# EAGLE design PAPx2-3 (EAGLE 7.2.0)
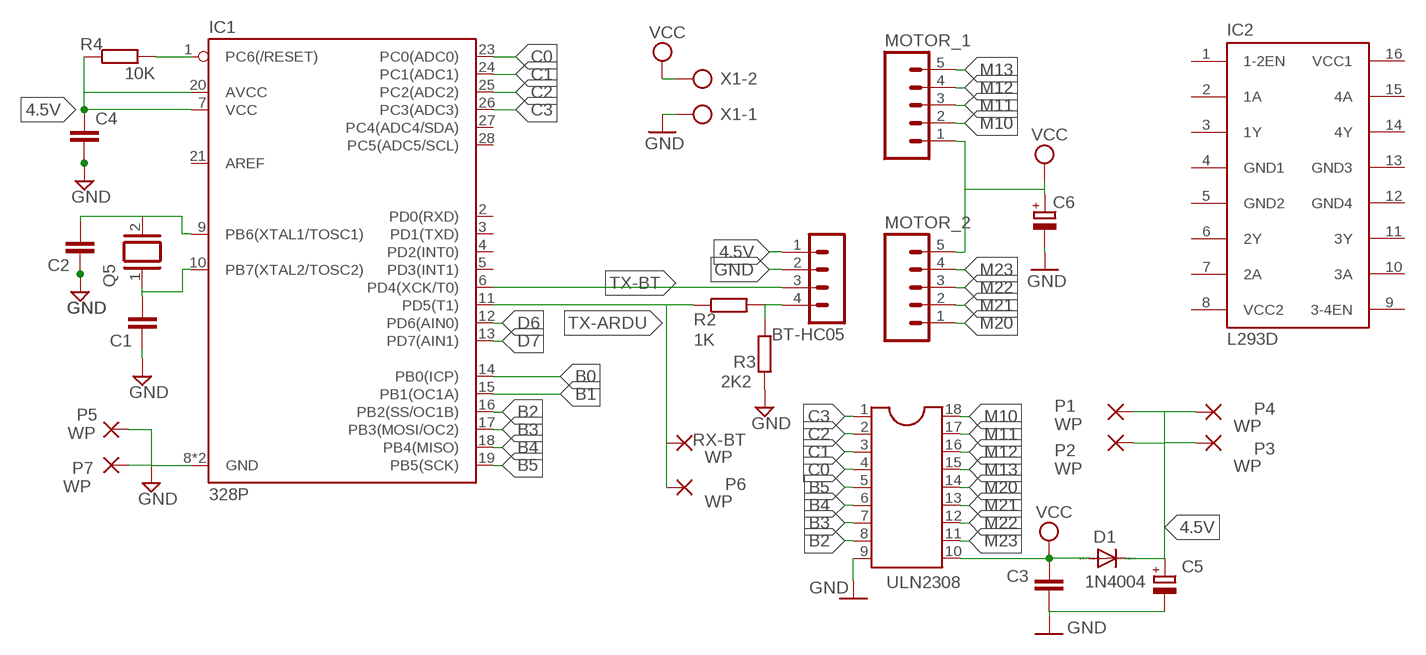
[diagram p0: schematic, sheet 1]

## Parts
BT-HC05  MA04-1  [MA04-1]
C1  C-EU025-025X050  [C025-025X050]
C2  C-EU025-025X050  [C025-025X050]
C3  C-EU050-025X075  [C050-025X075]
C4  C-EU050-025X075  [C050-025X075]
C5  CPOL-EUE2.5-5  [E2,5-5]
C6  CPOL-EUE2.5-5  [E2,5-5]
D1  1N4004  [DO41-10]
IC1  328P  ATMEGA328P  [DIP28]
IC2  L293D  [DIL16]
MOTOR_1  M05  [05P]
MOTOR_2  M05  [05P]
P1  WP  WIREPAD1,6/0,8  [1,6/0,8]
P2  WP  WIREPAD1,6/0,8  [1,6/0,8]
P3  WP  WIREPAD1,6/0,8  [1,6/0,8]
P4  WP  WIREPAD1,6/0,8  [1,6/0,8]
P5  WP  WIREPAD1,6/0,8  [1,6/0,8]
P6  WP  WIREPAD1,6/0,8  [1,6/0,8]
P7  WP  WIREPAD1,6/0,8  [1,6/0,8]
Q5  XTAL/S  [QS]
R2  1K  R-EU_0204/7  [0204/7]
R3  2K2  R-EU_0204/7  [0204/7]
R4  10K  R-EU_0204/7  [0204/7]
RX-BT  WP  WIREPAD1,6/0,8  [1,6/0,8]
ULN2308  DIL18  [DIL18]
X1  AK500/2  [AK500/2]

## Nets
4.5V: BT-HC05.1 C4.1 C5.+ D1.C IC1.7(VCC) IC1.20(AVCC) P1.1(P) P2.1(P) P3.1(P) P4.1(P) R4.1
B0: IC1.14(PB0(ICP))
B1: IC1.15(PB1(OC1A))
B2: IC1.16(PB2(SS/OC1B)) ULN2308.8
B3: IC1.17(PB3(MOSI/OC2)) ULN2308.7
B4: IC1.18(PB4(MISO)) ULN2308.6
B5: IC1.19(PB5(SCK)) ULN2308.5
C0: IC1.23(PC0(ADC0)) ULN2308.4
C1: IC1.24(PC1(ADC1)) ULN2308.3
C2: IC1.25(PC2(ADC2)) ULN2308.2
C3: IC1.26(PC3(ADC3)) ULN2308.1
D6: IC1.12(PD6(AIN0))
D7: IC1.13(PD7(AIN1))
GND: BT-HC05.2 C1.1 C2.1 C3.2 C4.2 C5.- C6.- IC1.8(GND) IC1.22(GND) P5.1(P) P7.1(P) R3.1 ULN2308.9 X1.1
M10: MOTOR_1.2 ULN2308.18
M11: MOTOR_1.3 ULN2308.17
M12: MOTOR_1.4 ULN2308.16
M13: MOTOR_1.5 ULN2308.15
M20: MOTOR_2.1 ULN2308.14
M21: MOTOR_2.2 ULN2308.13
M22: MOTOR_2.3 ULN2308.12
M23: MOTOR_2.4 ULN2308.11
N$1: BT-HC05.4 R2.2 R3.2
N$2: C1.2 IC1.10(PB7(XTAL2/TOSC2)) Q5.1
N$3: C2.2 IC1.9(PB6(XTAL1/TOSC1)) Q5.2
N$4: IC1.1(PC6(/RESET)) R4.2
TX-ARDU: IC1.11(PD5(T1)) P6.1(P) R2.1 RX-BT.1(P)
TX-BT: BT-HC05.3 IC1.6(PD4(XCK/T0))
VCC: C3.1 C6.+ D1.A MOTOR_1.1 MOTOR_2.5 ULN2308.10 X1.2
Unconnected: IC1.2(PD0(RXD)) IC1.3(PD1(TXD)) IC1.4(PD2(INT0)) IC1.5(PD3(INT1)) IC1.21(AREF) IC1.27(PC4(ADC4/SDA)) IC1.28(PC5(ADC5/SCL)) IC2.1(1-2EN) IC2.2(1A) IC2.3(1Y) IC2.6(2Y) IC2.7(2A) IC2.9(3-4EN) IC2.10(3A) IC2.11(3Y) IC2.14(4Y) IC2.15(4A)

## Power pins joined to a net without a drawn wire
GND1: IC2.4(GND1)
GND2: IC2.5(GND2)
GND3: IC2.13(GND3)
GND4: IC2.12(GND4)
VCC1: IC2.16(VCC1)
VCC2: IC2.8(VCC2)

## Library data of the parts
BT-HC05 = con-lstb:MA04-1: PIN HEADER; OC_FARNELL: unknown; OC_NEWARK: unknown
C1-C4 = rcl:C-EU: CAPACITOR, European symbol
C5 C6 = resistor:CPOL-EU: POLARIZED CAPACITOR, European symbol
D1 = diode:1N4004: DIODE general purpose rectifier, 1 A
IC1 = treser_lib:ATMEGA328P: Atmel ATMEGA328P 32kb flash, 1k EEPROM, 2k SRAM; PROD_ID: IC-09136
IC2 = treser_lib:L293D: Driver L293D Driver PUSH-PULL de 4 canales; MPN: L293D; OC_FARNELL: 9589619; OC_NEWARK: 56P8249
MOTOR_1 MOTOR_2 = con-amp-quick:M05: AMP QUICK CONNECTOR; OC_FARNELL: unknown; OC_NEWARK: unknown
P1-P7 RX-BT = wirepad:WIREPAD: Wire PAD connect wire on PCB
Q5 = special:XTAL/S: CRYSTAL
R2-R4 = resistor:R-EU_: RESISTOR, European symbol
ULN2308 = ic-package:DIL18: Dual In Line / Socket
X1 = con-ptr500:AK500/2: CONNECTOR; OC_FARNELL: unknown; OC_NEWARK: unknown

## Board
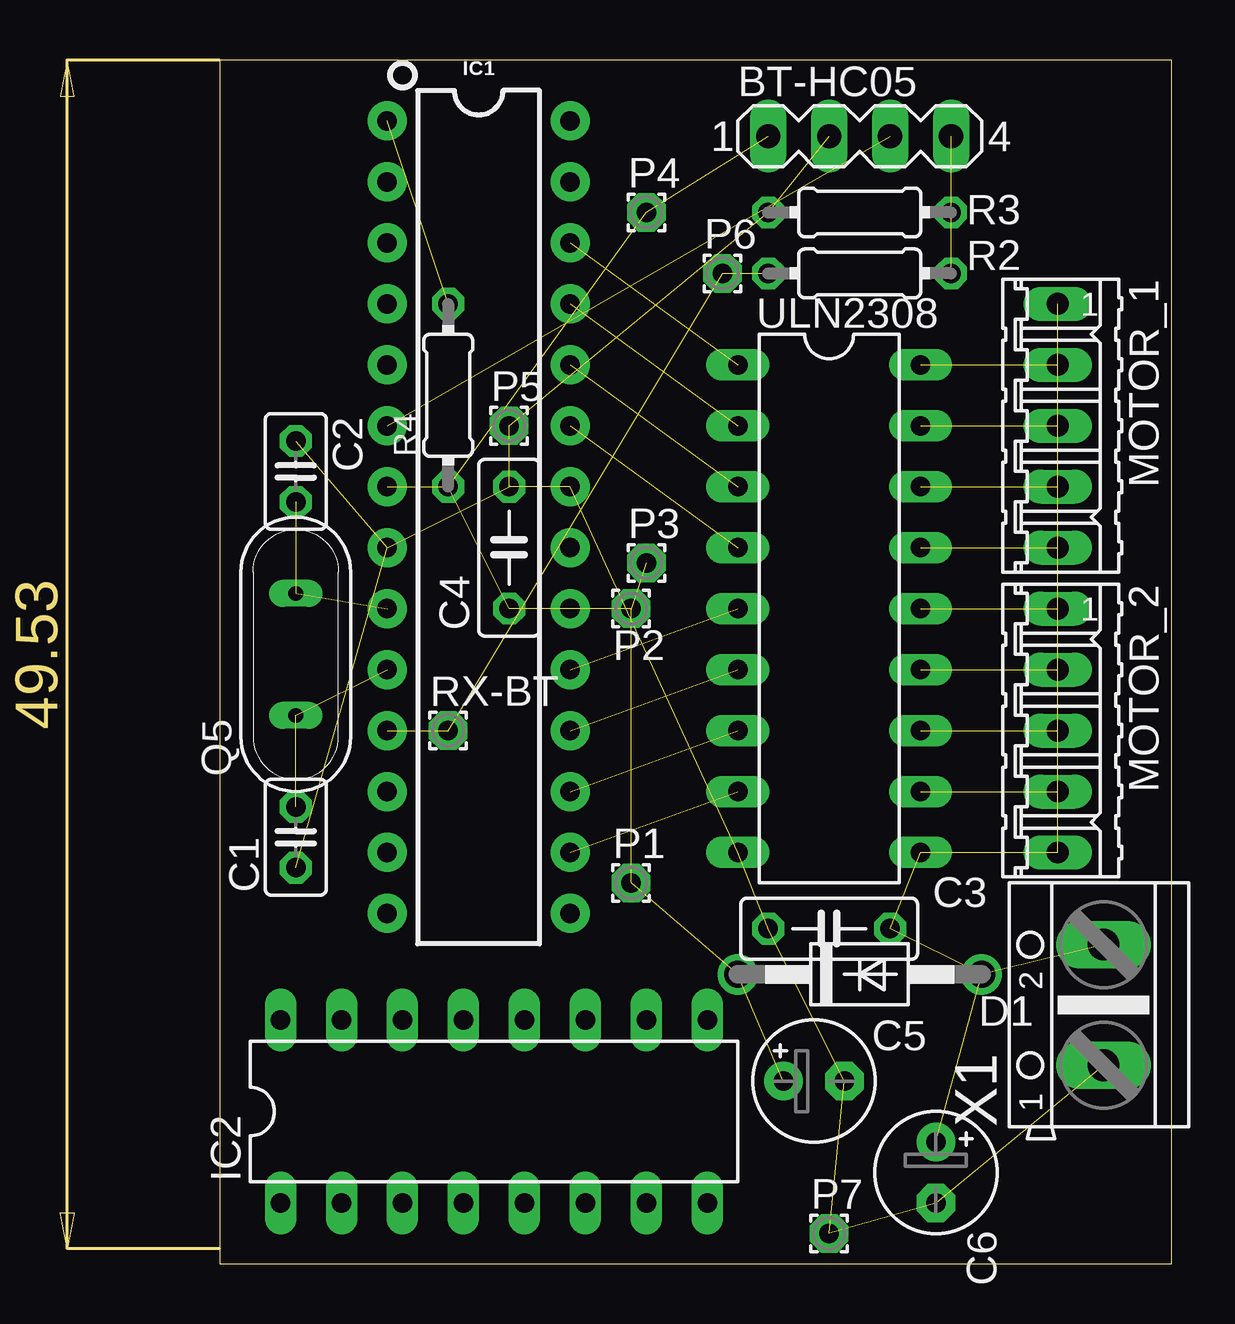
[diagram p1: board, top side]

Size 39.67 x 50.16 mm. Coordinates in mm from the lower left corner, seen from the top.
Outline: 0,0 39.67,0 39.67,50.16 0,50.16 0,0
Copper layers (1*16): Top 0.035mm / dielectric 1.5mm / Bottom 0.035mm
Design rules "default": minimum track width 10mil, minimum drill 24mil, track to track 8mil, track to pad 8mil, pad to pad 8mil, via to via 8mil, smd to smd 8mil, copper to edge 40mil, drill to drill 8mil, minimum pad ring 10mil, minimum via ring 8mil, stop-mask expansion 4mil, vias tented up to drill 0mil, thermal gap 10mil

### Footprints (pad centres in the part's own frame; a part is rotated, then mirrored left to right if it is on the bottom)
MA04-1 = drill 1.016 long: 1 -3.81,0; 2 -1.27,0; 3 1.27,0; 4 3.81,0
C025-025X050 = drill 0.813 octagon: 1 -1.27,0; 2 1.27,0
C050-025X075 = drill 0.813 octagon: 1 -2.54,0; 2 2.54,0
E2,5-5 = drill 0.813 pad 1.6: + -1.27,0 | drill 0.813 pad 1.6 octagon: - 1.27,0
DO41-10 = drill 1.118: A 5.08,0; C -5.08,0
DIP28 = drill 0.813 pad 1.626: 1 -16.51,-3.81; 2 -13.97,-3.81; 3 -11.43,-3.81; 4 -8.89,-3.81; 5 -6.35,-3.81; 6 -3.81,-3.81; 7 -1.27,-3.81; 8 1.27,-3.81; 9 3.81,-3.81; 10 6.35,-3.81; 11 8.89,-3.81; 12 11.43,-3.81; 13 13.97,-3.81; 14 16.51,-3.81; 15 16.51,3.81; 16 13.97,3.81; 17 11.43,3.81; 18 8.89,3.81; 19 6.35,3.81; 20 3.81,3.81; 21 1.27,3.81; 22 -1.27,3.81; 23 -3.81,3.81; 24 -6.35,3.81; 25 -8.89,3.81; 26 -11.43,3.81; 27 -13.97,3.81; 28 -16.51,3.81
DIL16 = drill 0.813 long: 1 -8.89,-3.81; 2 -6.35,-3.81; 3 -3.81,-3.81; 4 -1.27,-3.81; 5 1.27,-3.81; 6 3.81,-3.81; 7 6.35,-3.81; 8 8.89,-3.81; 9 8.89,3.81; 10 6.35,3.81; 11 3.81,3.81; 12 1.27,3.81; 13 -1.27,3.81; 14 -3.81,3.81; 15 -6.35,3.81; 16 -8.89,3.81
05P = drill 0.914 long: 1 -5.08,0; 2 -2.54,0; 3 0,0; 4 2.54,0; 5 5.08,0
1,6/0,8 = drill 0.813 pad 1.6 octagon: 1 0,0
QS = drill 0.61 long: 1 -2.54,0; 2 2.54,0
0204/7 = drill 0.813 octagon: 1 -3.81,0; 2 3.81,0
DIL18 = drill 0.813 long: 1 -10.16,-3.81; 2 -7.62,-3.81; 3 -5.08,-3.81; 4 -2.54,-3.81; 5 0,-3.81; 6 2.54,-3.81; 7 5.08,-3.81; 8 7.62,-3.81; 9 10.16,-3.81; 10 10.16,3.81; 11 7.62,3.81; 12 5.08,3.81; 13 2.54,3.81; 14 0,3.81; 15 -2.54,3.81; 16 -5.08,3.81; 17 -7.62,3.81; 18 -10.16,3.81
AK500/2 = drill 1.321 long: 1 -2.515,0; 2 2.515,0

### Placement (x,y rotation side)
BT-HC05  26.67,46.99 0 top
C1  3.18,17.78 90 top
C2  3.18,33.02 270 top
C3  25.4,13.97 180 top
C4  12.06,29.85 90 top
C5  24.76,7.62 0 top
C6  29.85,3.81 270 top
D1  26.67,12.07 0 top
IC1  10.79,31.11 270 top
IC2  11.43,6.35 0 top
MOTOR_1  34.92,34.92 270 top
MOTOR_2  34.92,22.22 270 top
P1  17.14,15.88 0 top
P2  17.14,27.31 0 top
P3  17.78,29.21 0 top
P4  17.78,43.81 0 top
P5  12.06,34.92 0 top
P6  20.96,41.28 0 top
P7  25.4,1.27 0 top
Q5  3.18,25.4 90 top
R2  26.67,41.28 0 top
R3  26.67,43.81 0 top
R4  9.52,36.2 90 top
RX-BT  9.52,22.22 0 top
ULN2308  25.4,27.31 270 top
X1  36.83,10.8 90 top

### Tracks (layer width: path | path; a pad name or v marks a point on that pad's centre or on a via)
4.5V  (via drill 0.6)  (10 unrouted)
  other vias: 17.78,43.81
B2  (1 unrouted)
B3  (1 unrouted)
B4  (1 unrouted)
B5  (1 unrouted)
C0  (1 unrouted)
C1  (1 unrouted)
C2  (1 unrouted)
C3  (1 unrouted)
GND  (13 unrouted)
M10  (1 unrouted)
M11  (1 unrouted)
M12  (1 unrouted)
M13  (1 unrouted)
M20  (1 unrouted)
M21  (1 unrouted)
M22  (1 unrouted)
M23  (1 unrouted)
N$1  (2 unrouted)
N$2  (2 unrouted)
N$3  (2 unrouted)
N$4  (1 unrouted)
TX-ARDU  (3 unrouted)
TX-BT  (1 unrouted)
VCC  (6 unrouted)